# Altium schematic sheet Sheet1.SchDoc
size A4; SheetNumber: 1; SheetTotal: 1
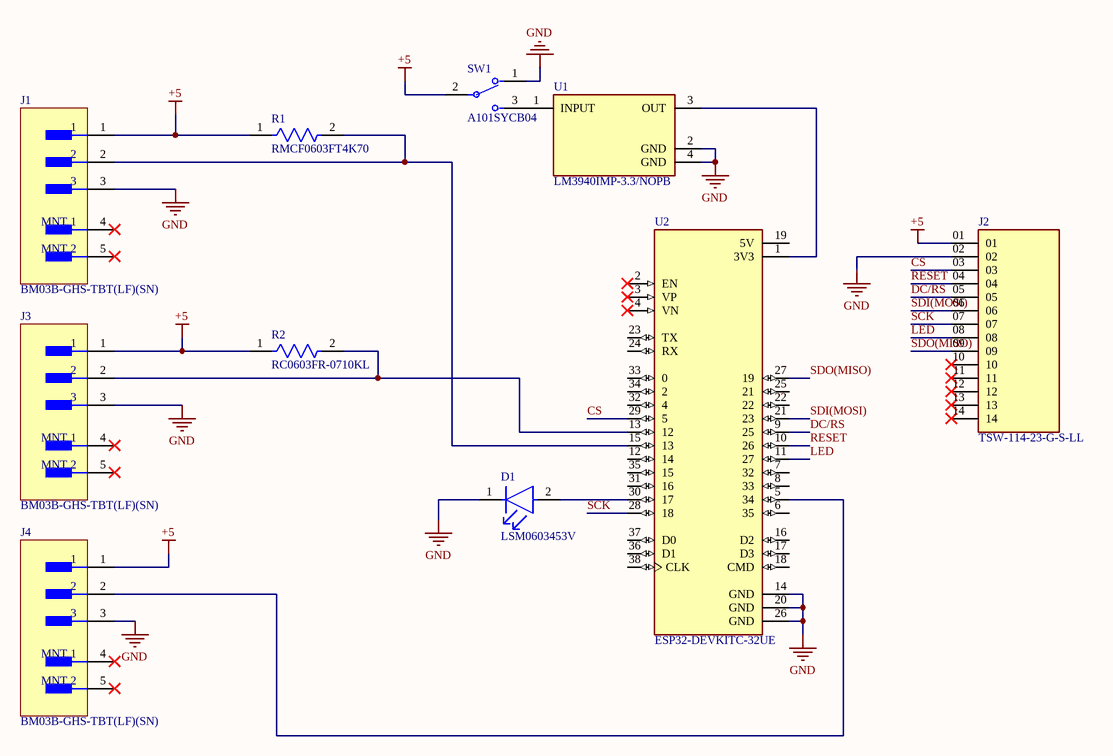
[diagram p0: Sheet1.SchDoc]

## Parts
D1  LSM0603453V  [FP-LSM0603453V-MFG]
J1  BM03B-GHS-TBT(LF)(SN)  [FP-BM03B-GHS-TBT_LF_SN-MFG]
J2  TSW-114-23-G-S-LL  [SAMTEC_TSW-114-23-G-S-LL]
J3  BM03B-GHS-TBT(LF)(SN)  [FP-BM03B-GHS-TBT_LF_SN-MFG]
J4  BM03B-GHS-TBT(LF)(SN)  [FP-BM03B-GHS-TBT_LF_SN-MFG]
R1  RMCF0603FT4K70  [FP-RMCF0603-IPC_B]
R2  RC0603FR-0710KL  [FP-RC0603-0_55-IPC_C]
SW1  A101SYCB04  [FP-A101SYCB04-MFG]
U1  LM3940IMP-3.3/NOPB  [FP-DCY0004A-MFG]
U2  ESP32-DEVKITC-32UE  [ESPRESSIF_ESP32-DEVKITC-32UE]

## Nets
+5: J1.1 J2.01 J3.1 J4.1 R1.1 R2.1 SW1.2
GND: D1.1(C) J1.3 J2.02 J3.3 J4.3 SW1.1 U1.2(GND) U1.4(GND) U2.14(GND) U2.20(GND) U2.26(GND)
CS: J2.03 U2.29(5)
DC/RS: J2.05 U2.9(25)
LED: J2.08 U2.11(27)
RESET: J2.04 U2.10(26)
SCK: J2.07 U2.28(18)
SDI(MOSI): J2.06 U2.21(23)
SDO(MISO): J2.09 U2.27(19)
NetD1_2: D1.2(A) U2.30(17)
NetJ1_2: J1.2 R1.2 U2.15(13)
NetJ3_2: J3.2 R2.2 U2.13(12)
NetJ4_2: J4.2 U2.5(34)
NetSW1_3: SW1.3 U1.1(INPUT)
NetU1_3: U1.3(OUT) U2.1(3V3)

Not connected (* = marked no-connect by the designer): J1 4(MNT_1)* 5(MNT_2)*; J2 10* 11* 12* 13* 14*; J3 4(MNT_1)* 5(MNT_2)*; J4 4(MNT_1)* 5(MNT_2)*; U2 2(EN)* 3(VP)* 4(VN)* 6(35) 7(32) 8(33) 12(14) 16(D2) 17(D3) 18(CMD) 19(5V) 22 23(TX) 24(RX) 25(21) 31(16) 32(4) 33(0) 34(2) 35(15) 36(D1) 37(D0) 38(CLK)

## Library data of the parts
D1 = CMP-00731-94024739-1: LSM0603453V LED SM 0603 3V -/1000/-mcd Green; Forward Current: 20mA; Forward Voltage: 2.3V; Viewing Angle: 120°; Reverse Voltage: 5V; Power Dissipation: 60mW; Wavelength: 576nm; Luminous Intensity: 120mcd; NexarPartId: 94024739; Height: 550µm; Max Operating Temperature: 85°C; Schedule B: 8541402000, 8541406050; Case/Package: 0603; Color: Green; Min Operating Temperature: -40°C
J1 J3 J4 = CMP-17439-000130-2: CONN HEADER SMD 3POS 1.25MM; Voltage Rating: 50V; Number of Contacts: 3; Current Rating: 1A; Lead Free: Lead Free; Max Operating Temperature: 85°C; Min Operating Temperature: -25°C; Voltage Rating (AC): 50V; Height: 4.05mm; REACH SVHC: No SVHC; Housing Material: Nylon; Mount: Surface Mount; Housing Color: Natural; Contact Material: Copper, Tin; Contact Plating: Tin; Length: 7mm; Termination: Crimp, Solder; Packaging: Cut Tape; RoHS: Compliant; Number of Positions: 3; Width: 4.25mm; Orientation: Straight; Pitch: 1.25mm; Number of Rows: 1; Lead Pitch: 1.25mm
R1 = CMP-26527-005485-1: 4.7kΩ ±1% 0.1W 0603 Thick Film Chip Resistor AEC-Q200 compliant; Temperature Coefficient: 100ppm/°C; Power Rating: 100mW; Resistance: 4.7kR; Radiation Hardening: No; Packaging: Tape and Reel; Series: RMCF; Min Operating Temperature: -55°C; Tolerance: 1%; RoHS Compliant: Yes; Number of Terminations: 2; Depth: 0.8mm; Width: 0.031inch; Resistor Type: Thick Film; Height: 0.022inch; Contact Plating: Tin; Military Standard: Not; Construction: Rectangular; Case Code (Imperial): 0603; Max Power Dissipation: 100mW; Max Operating Temperature: 155°C; Features: Automotive AEC-Q200; Case/Package: 0603; Case Code (Metric): 1608; Lead Free: Lead Free; Mount: Surface Mount; Length: 1.55mm
R2 = CMP-2100-03664-2: RES 10K OHM 1% 1/10W 0603; Voltage Rating: 75V; Voltage Rating (DC): 50V; Resistance: 10kR; Power Rating: 100mW; Temperature Coefficient: 100ppm/°C; Depth: 0.8mm; Termination: SMD/SMT; Resistor Type: Thick Film; Series: RC; Construction: Rectangular; Features: Moisture Resistant; Packaging: Tape and Reel; Min Operating Temperature: -55°C; Number of Terminations: 2; Lead Pitch: 0.3mm; RoHS Compliant: Yes; Case/Package: 0603; Resistance Tolerance: 1%; Military Standard: Not; Weight: 7.1E-05oz; Number of Pins: 2; Tolerance: 1%; Length: 1.6mm; Case Code (Imperial): 0603; Lead Free: Lead Free; Width: 0.8mm; Max Power Dissipation: 100mW; Height: 0.45mm; Max Operating Temperature: 155°C; Case Code (Metric): 1608; Size Code: 0603
SW1 = CMP-03408-000017-1: SWITCH TOGGLE SPDT 0.4VA 20V; Electrical Life: 6000Cycles; Number of Poles: 1; Power Rating: 400mW; Switch Function: On-On; Contact Resistance: 10mR; Contact Current Rating: 400mA; Actuator Material: Phenolic; Insulation Resistance: 30MR; Actuator Color: Chrome; Number of Positions: 2; Actuator Type: Standard Round; Actuator Length: 10.41mm; Illumination Type: Non-Illuminated; Flammability Rating: UL94 V-1; Contact Material: Copper; Depth: 6.86mm; Contact Plating: Gold; Voltage Rating (AC): 20V; Max Voltage Rating (DC): 20V; Min Operating Temperature: -30°C; Max Operating Temperature: 85°C; Throw Configuration: SPDT; Packaging: Bulk; Termination: PC Pins; Series: Gemini A; ELV: Compliant; Lead Free: Lead Free; RoHS Compliant: Yes; REACH SVHC: No SVHC; Mount: Panel; Orientation: Straight; Package Quantity: 100; Max Voltage Rating (AC): 20V; Radiation Hardening: No; Voltage Rating (DC): 20V
U1 = CMP-0062-01788-4: IC REG LINEAR 3.3V 1A SOT223-4; Min Input Voltage: 4.5V; Max Supply Voltage: 7.5V; Number of Outputs: 1; Output Type: Fixed; Polarity: Positive; Dropout Voltage: 500mV; Quiescent Current: 15mA; Max Output Voltage: 3.3V; Length: 6.5mm; Termination: SMD/SMT; Width: 3.56mm; Min Supply Voltage: 4.5V; Max Output Current: 1A; Case/Package: SOT-223; Output Voltage: 3.3V; Current Rating: 1A; Packaging: Tape and Reel; Lead Free: Lead Free; Nominal Output Voltage: 3.3V; Height: 1.6mm; Series: -; Output Configuration: Positive; Radiation Hardening: No; Number of Regulators: 1; Package Quantity: 1000; REACH SVHC: No SVHC; Max Input Voltage: 7.5V; Max Operating Temperature: 125°C; Min Operating Temperature: -40°C; Output Current: 1A; Contact Plating: Tin; Number of Pins: 4; Mount: Surface Mount
U2 = ESP32-DEVKITC-32UE: ESP32-WROOM-32UE series Transceiver; 802.11 b/g/n (Wi-Fi, WiFi, WLAN), BluetoothÂ® Smart Ready 4.x Dual Mode Evaluation Board; MF: Espressif Systems; Package: None; Price: None; MP: ESP32-DEVKITC-32UE; Availability: In Stock; Value: *; Check_prices: https://www.snapeda.com/parts/ESP32-DEVKITC-32UE/Espressif+Systems/view-part/?ref=eda; Purchase-URL: https://pricing.snapeda.com/search/part/ESP32-DEVKITC-32UE/?ref=eda; SnapEDA_Link: https://www.snapeda.com/parts/ESP32-DEVKITC-32UE/Espressif+Systems/view-part/?ref=snap
J2 = TSW-114-23-G-S-LL: Package: None; Price: None; Value: *; MP: TSW-114-23-G-S-LL; Availability: Unavailable